# Altium schematic sheet Power.SchDoc: Localization
size Letter; DrawnBy: Alaina Hansen, Cindy Li; Organization: Altium Limited; Address1: L3, 12a Rodborough Rd; Address2: Frenchs Forest; Address3: NSW; Address4: Australia 2086; SheetNumber: 1; SheetTotal: 6
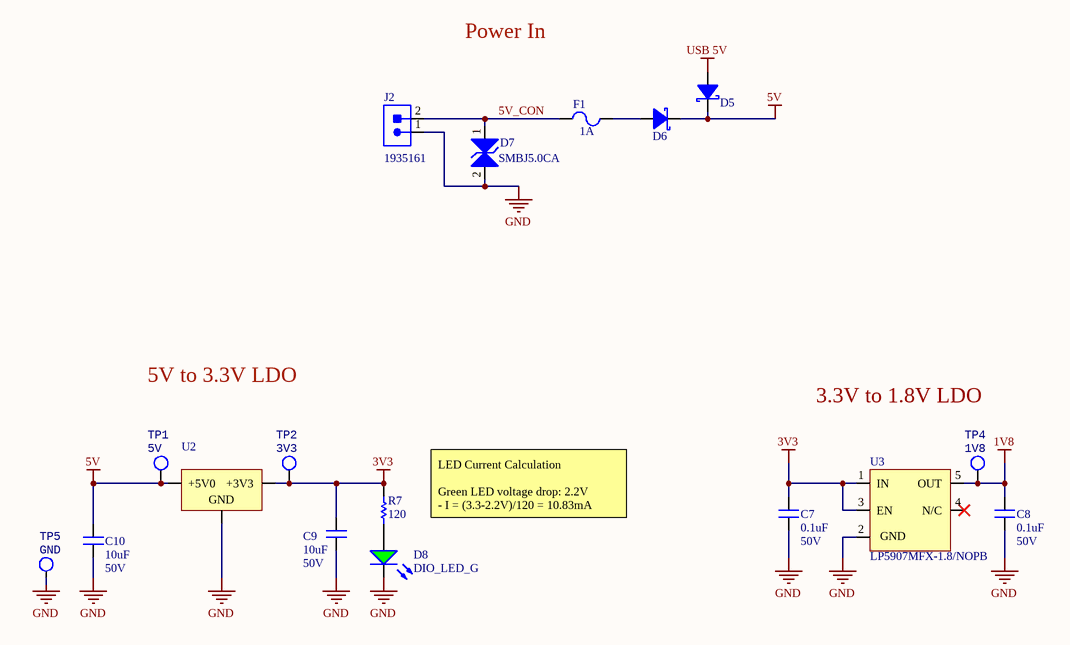
[diagram p0: Power.SchDoc]

## Parts
C7  value 0.1uF  Voltage Rating: 50V  [CAPC2012X140N]  (hidden comment: CAP_0.1uF_50V_0805)
C8  value 0.1uF  Voltage Rating: 50V  [CAPC2012X140N]  (hidden comment: CAP_0.1uF_50V_0805)
C9  Voltage Rating: 50V  [CAPC1206(3216)]  (hidden comment: 10uF)
C10  Voltage Rating: 50V  [CAPC1206(3216)]  (hidden comment: 10uF)
D5  DIO_SCHOTTKY_30V_800mA  [DIO_CUS520,H3F]  (value not drawn)
D6  DIO_SCHOTTKY_30V_800mA  [DIO_CUS520,H3F]  (value not drawn)
D7  Manufacturer Part Number 1: SMBJ5.0CA  [TVS_DIODE_BIDIRECTIONAL]  (hidden comment: TVS_DIODE_BIDIR_5V)
D8  DIO_LED_G  [LED_0805_LINE]
F1  Current Rating: 1A  [FUSC3215X78N]  (hidden comment: FUSE_1A_1206)
J2  CON_2M_TERM  [1935161]  (value not drawn)
R7  value 120  [RESC0603(1608)_N]  (hidden comment: RES_120R_0603)
TP1  5V  [TESTPOINT_LOOP]
TP2  3V3  [TESTPOINT_LOOP]
TP4  1V8  [TESTPOINT_LOOP]
TP5  GND  [TESTPOINT_LOOP]
U2  5V0_3V3_LDO  [VOLTAGE_REGULATOR]  (value not drawn)
U3  LDO_1.8V_250mA  [LP5907MFX-1.8/NOPB]  (value not drawn)

## Nets
1V8: C8.2 TP4.1 U3.5(OUT)
3V3: C7.2 C9.2 R7.2 TP2.1 U2.2(+3V3) U3.1(IN) U3.3(EN)
5V: C10.2 D5.2(Cathode) D6.2(Cathode) TP1.1 U2.3(+5V0)
GND: C7.1 C8.1 C9.1 C10.1 D7.2 D8.2(K) J2.1 TP5.1 U2.1(GND) U3.2(GND)
USB 5V: D5.1(Anode)
5V_CON: D7.1 F1.1 J2.2
NetD6_1: D6.1(Anode) F1.2
NetD8_1: D8.1(A) R7.1

Not connected (* = marked no-connect by the designer): U3 4(N/C)*

## Notes on the sheet
- Power In
- 5V to 3.3V LDO
- 3.3V to 1.8V LDO
- LED Current Calculation
  Green LED voltage drop: 2.2V
  - I = (3.3-2.2V)/120 = 10.83mA
- Title
- Size:
- Date:
- Letter
- Drawn By:
- Sheet
- of
- File:

## Library data of the parts
C7 C8 = CAP_0.1uF_50V_0805: CAP CER 0.1UF 50V X7R 0805; Manufacturer 1: Murata Electronics; Manufacturer Part Number 1: GCD21BR71H104KA01L; Capacitance: 100nF; Tolerance: 10%; Mount: Surface Mount; Case/Package: 0805; Case Code (Metric): 2012; Case Code (Imperial): 0805; Min Operating Temperature: -55°C; Max Operating Temperature: 125°C; Dielectric: X7R; Termination: SMD/SMT; Length: 2mm; Height: 1.25mm; Width: 0.049inch; Thickness: 0.049inch; Depth: 1.25mm; Ratings: AEC-Q200; ComponentLink1URL: https://datasheet.ciiva.com/29537/c03e-29537701.pdf?src-supplier=Digi-Key; ComponentLink1Description: https://datasheet.ciiva.com/29537/c03e-29537701.pdf?src-supplier=Digi-Key; Supplier 1: Digi-Key; Supplier Part Number 1: 490-11955-1-ND
C9 C10 = CAP_10uF_50V_1206: CAP CER 10UF 50V X5R 1206; Manufacturer Part Numer 1: GRT31CR61H106KE01L; Manufacturer 1: Murata; Dimensions: 0.126" L x 0.063" W (3.20mm x 1.6mm); Package: 1206 (3216 Metric); Supplier Part Number 1: 490-12456-1-ND; Supplier 1: Digi-Key; Value: 10uF; Mount: Surface Mount
D5 D6 = DIO_SCHOTTKY_30V_800mA: DIODE SCHOTTKY 30V 800MA USC; Manufacturer 1: Toshiba Semiconductor and Storage; Manufacturer Part Number 1: CUS08F30,H3F; Vf (Max): 220mV; Supplier 1: Digi-Key; Supplier Part Number 1: CUS08F30H3FCT-ND; Mount: Surface Mount; Vr (Max): 30V; Io: 800mA
D7 = TVS_DIODE_BIDIR_5V: TVS DIODE 5V 9.2V DO214AA; Manufacturer 1: Littelfuse; Direction: Bidirectional; Max Surge Current: 65.3A; Reverse Breakdown Voltage: 6.4V; Peak Pulse Power: 600W; Max Breakdown Voltage: 7V; ESD Protection: Yes; Package: DO-214AA, SMB; ComponentLink1Description: Datasheet; ComponentLink1URL: https://www.littelfuse.com/~/media/electronics/datasheets/tvs_diodes/littelfuse_tvs_diode_smbj_datasheet.pdf.pdf; Supplier Part Number 1: SMBJ5.0CALFCT-ND; Supplier 1: Digi-Key; Mount: Surface Mount; Min Operating Temperature: -65°C; Max Operating Temperature: 150°C; Reverse Standoff Voltage: 5V; Min Breakdown Voltage: 6.4V; Clamping Voltage: 9.2V; Breakdown Voltage: 6.4V; Polarity: Bidirectional; Power Dissipation: 600W; Peak Pulse Current: 65.3A; Composition: Zener
D8 = DIO_LED_G: LED GREEN DIFFUSED 0805 SMD; Manufacturer Part Number 1: LG R971-KN-1; Manufacturer 1: OSRAM; Forward Voltage Drop: 2.2V; Package: 0805 (2012 Metric); Supplier Part Number 1: 475-1410-1-ND; Supplier 1: Digi-Key; Mount: Surface Mount
F1 = FUSE_1A_1206: FUSE BOARD MOUNT 1A 125VAC 63VDC; Manufacturer 1: Bel Fuse Inc.; Manufacturer Part Number 1: C1Q 1; Voltage Rating DC: 63V; Supplier 1: Digi-Key; Supplier Part Number 1: 507-1077-1-ND; Mount: Surface Mount
J2 = CON_2M_TERM: TERM BLK 2POS SIDE ENTRY 5MM; Manufacturer 1: Phoenix Contact; Current: 18A; Voltage: 300V; Connector Type: Screw; Voltage Rating (DC): 320V; Max Current Rating: 16A; Max Supply Voltage: 250V; Current Rating: 17.5A; Number of Poles: 2; Number of Levels: 1; Wire Gauge (Max): 26AWG; Wire Gauge (Min): 12AWG; Approvals: UL; Manufacturer Part Number 1: 1935161; Supplier Part Number 1: 277-1667-ND; Supplier 1: Digi-Key; Pitch: 5mm; Stock 1: 15494; Pricing 1: 1=0.43000, 10=0.41100, 50=0.39280, 100=0.38200, 250=0.35700, 500=0.32844, 1000=0.30350 (USD); RoHS: Yes; Mount: Through Hole; Number of Pins: 2; Weight: 0.067021oz; Contact Material: Copper,Tin; Insulation Material: Nylon; Housing Material: Polyamide; Housing Color: Green; Color: Green; Material: Nylon; Number of Rows: 1; Voltage Rating: 250V; Package Quantity: 250; Packaging: Bulk; Number of Positions: 2; Number of Positions Per Level: 2; Termination: Solder; Number of Contacts: 2; Number of Circuits: 2; Orientation: Straight; Length: 9mm; Height: 11.3mm; Width: 14.9mm; Depth: 9mm; Wire/Cable Gauge: 26AWG; Radiation Hardening: No; Flammability Rating: UL94 V-0; Lead Free: Lead Free; REACH SVHC: Unknown; ComponentLink1URL: https://datasheet.ciiva.com/15169/getdatasheetpartid-177903-15169663.pdf?src-supplier=Verical; ComponentLink1Description: https://datasheet.ciiva.com/15169/getdatasheetpartid-177903-15169663.pdf?src-supplier=Verical; ComponentLink2URL: https://datasheet.ciiva.com/16047/1935161-16047247.pdf?src-supplier=Onlinecomponents.com; ComponentLink2Description: https://datasheet.ciiva.com/16047/1935161-16047247.pdf?src-supplier=Onlinecomponents.com; ComponentLink3URL: https://datasheet.ciiva.com/824/combiconcompact5-0mmseries-824222.pdf?src-supplier=Digi-Key; ComponentLink3Description: https://datasheet.ciiva.com/824/combiconcompact5-0mmseries-824222.pdf?src-supplier=Digi-Key
R7 = RES_120R_0603: RES SMD 120 OHM 5% 1/10W 0603; Manufacturer 1: Yageo; Manufacturer Part Number 1: RC0603JR-07120RL; Package: 0603 (1608 Metric); Dimensions: 0.063" L x 0.031" W (1.60mm x 0.80mm); Tolerance: 5%; Supplier Part Number 1: 311-120GRCT-ND; Supplier 1: Digi-Key; Mount: Surface Mount
TP1 TP2 TP4 TP5 = TESTPOINT_LOOP: Loop testpoint through-hole pad; Manufacturer Part Number 1: 5002; Manufacturer 1: Keystone Electronics; Supplier Part Number 1: 36-5002-ND; Supplier 1: Digi-Key; Mount: Through Hole
U2 = 5V0_3V3_LDO: IC REG LINEAR 3.3V 1A DPAK; Manufacturer Part Number 1: NCP1117DT33T5G; Manufacturer 1: ON Semiconductor; Current Output: 1A; Supplier Part Number 1: NCP1117DT33T5GOSCT-ND; Supplier 1: Digi-Key; Mount: Surface Mount
U3 = LDO_1.8V_250mA: IC REG LINEAR 1.8V 250MA SOT23-5; Manufacturer 1: Texas Instruments; Manufacturer Part Number 1: LP5907MFX-1.8/NOPB; Current Output: 250mA; Supplier Part Number 1: 296-41463-1-ND; Supplier 1: Digi-Key; Mount: Surface Mount